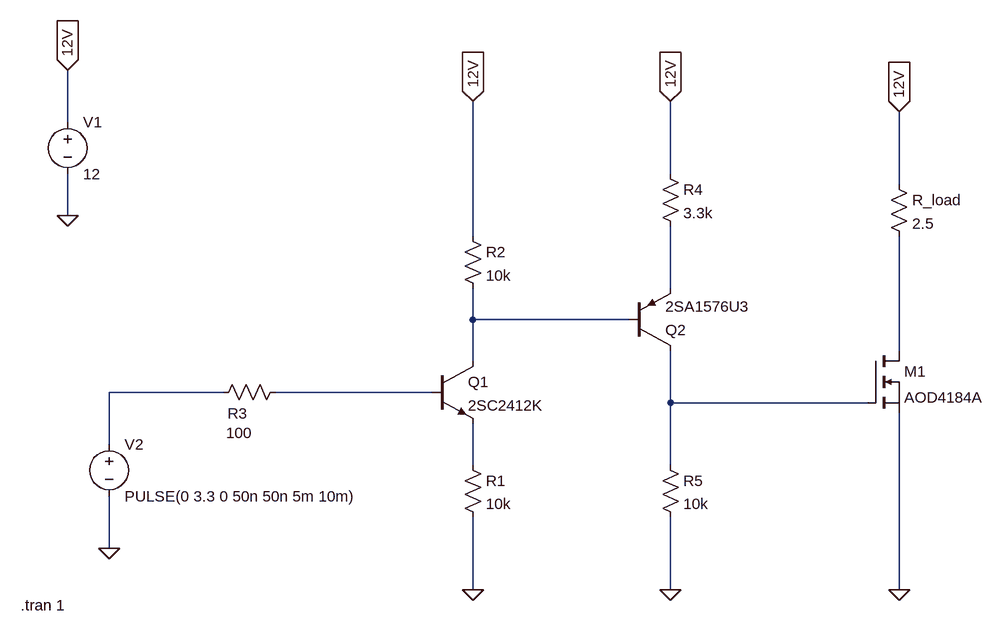
[diagram p0: schematic Low_Side_Low_Frequency_Switch_concept_01.asc]
Low_Side_Low_Frequency_Switch_concept_01.asc, the LTspice schematic file:
Version 4
SHEET 1 1848 824
WIRE 432 64 432 -16
WIRE 1360 144 1360 32
WIRE 1712 160 1712 48
WIRE 432 208 432 144
WIRE 1056 240 1056 32
WIRE 1360 320 1360 224
WIRE 1056 368 1056 320
WIRE 1296 368 1056 368
WIRE 1712 416 1712 240
WIRE 1056 432 1056 368
WIRE 672 480 496 480
WIRE 992 480 752 480
WIRE 1360 496 1360 416
WIRE 1664 496 1360 496
WIRE 496 560 496 480
WIRE 1056 592 1056 528
WIRE 1360 592 1360 496
WIRE 496 720 496 640
WIRE 1056 784 1056 672
WIRE 1360 784 1360 672
WIRE 1712 784 1712 512
FLAG 432 208 0
FLAG 432 -16 12V
IOPIN 432 -16 In
FLAG 1056 784 0
FLAG 496 720 0
FLAG 1056 32 12V
IOPIN 1056 32 In
FLAG 1360 784 0
FLAG 1360 32 12V
IOPIN 1360 32 In
FLAG 1712 48 12V
IOPIN 1712 48 In
FLAG 1712 784 0
SYMBOL voltage 432 48 R0
WINDOW 123 0 0 Left 0
WINDOW 39 0 0 Left 0
SYMATTR InstName V1
SYMATTR Value 12
SYMBOL npn 992 432 R0
SYMATTR InstName Q1
SYMATTR Value 2SC2412K
SYMBOL res 1040 576 R0
SYMATTR InstName R1
SYMATTR Value 10k
SYMBOL res 1040 224 R0
SYMATTR InstName R2
SYMATTR Value 10k
SYMBOL voltage 496 544 R0
WINDOW 123 0 0 Left 0
WINDOW 39 0 0 Left 0
SYMATTR InstName V2
SYMATTR Value PULSE(0 3.3 0 50n 50n 5m 10m)
SYMBOL res 768 464 R90
WINDOW 0 64 74 VBottom 2
WINDOW 3 63 72 VTop 2
SYMATTR InstName R3
SYMATTR Value 100
SYMBOL pnp 1296 416 M180
SYMATTR InstName Q2
SYMATTR Value 2SA1576U3
SYMBOL res 1344 128 R0
SYMATTR InstName R4
SYMATTR Value 3.3k
SYMBOL res 1344 576 R0
SYMATTR InstName R5
SYMATTR Value 10k
SYMBOL nmos 1664 416 R0
SYMATTR InstName M1
SYMATTR Value AOD4184A
SYMBOL res 1696 144 R0
SYMATTR InstName R_load
SYMATTR Value 2.5
TEXT 360 808 Left 2 !.tran 1

The netlist it stands for:
* Low_Side_Low_Frequency_Switch_concept_01.asc
V1 12V 0 12
Q1 N002 N005 N007 0 2SC2412K
R1 N007 0 10k
R2 12V N002 10k
V2 N004 0 PULSE(0 3.3 0 50n 50n 5m 10m)
R3 N005 N004 100
Q2 N006 N002 N001 0 2SA1576U3
R4 12V N001 3.3k
R5 N006 0 10k
M1 N003 N006 0 0 AOD4184A
R_load 12V N003 2.5
.model NPN NPN
.model PNP PNP
.lib standard.bjt
.model NMOS NMOS
.model PMOS PMOS
.lib standard.mos
.tran 1
.backanno
.end